# Altium schematic sheet QS30-HV.SchDoc
size A4
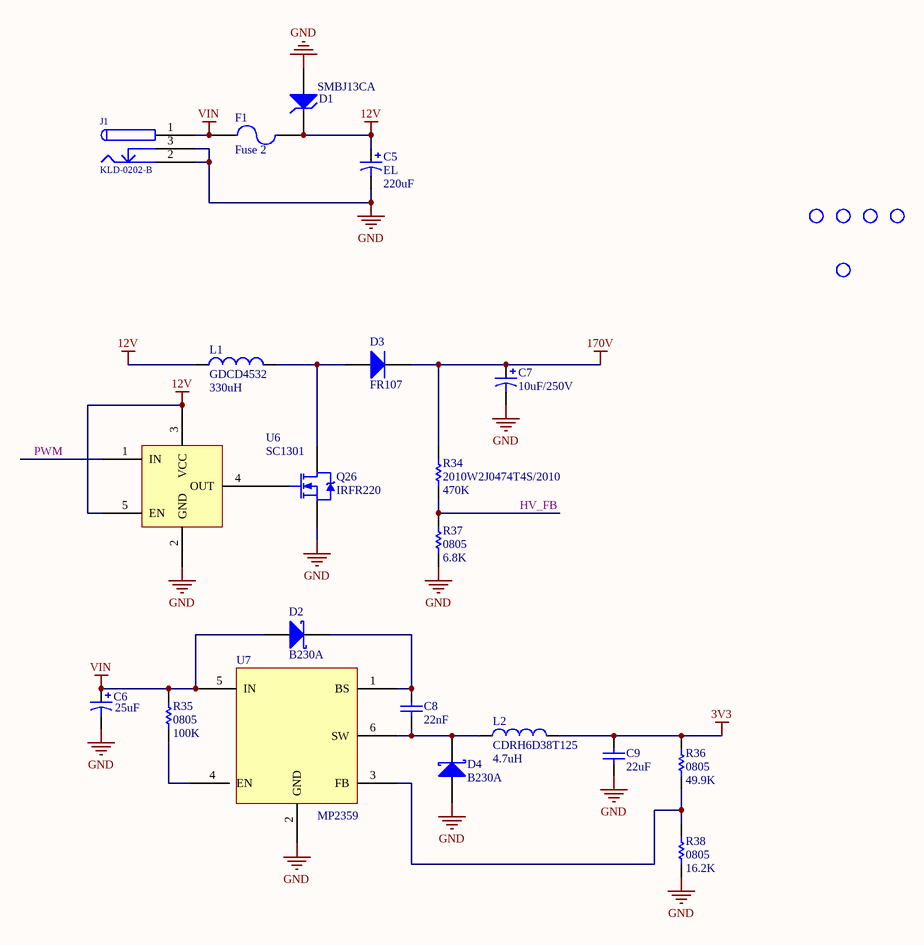
[diagram p0: QS30-HV.SchDoc]

## Parts
C5  EL  value 220uF  [220UF_16V_SMD_CAP]
C6  value 25uF  [C1210]
C7  value 10uF/250V  [C10.2 - SMD]  (hidden comment: Cap Pol1)
C8  value 22nF  [6-0805_N]  (hidden comment: Cap)
C9  value 22uF  [C1210]  (hidden comment: Cap)
D1  SMBJ13CA  [SMB]
D2  B230A  [SOD123]
D3  FR107  [DSO-C2/X1.8]
D4  B230A  [SOD123]
F1  Fuse 2  [1812]
g1  g固定过孔  [固定过孔]  (value not drawn)
g2  g固定过孔  [固定过孔]  (value not drawn)
g3  g固定过孔  [固定过孔]  (value not drawn)
g4  g固定过孔  [固定过孔]  (value not drawn)
g6  g固定过孔  [PCBComponent_1 - duplicate3]  (value not drawn)
J1  KLD-0202-B  [DC_JACK_SMT_4.0_1.7]
L1  GDCD4532  value 330uH  [GDCD4532]
L2  CDRH6D38T125  value 4.7uH  [GDCD4532]
Q26  IRFR220  [TO-252AA_N]
R34  2010W2J0474T4S/2010  value 470K  [12Z-2010]
R35  0805  value 100K  [1608[0603]]
R36  0805  value 49.9K  [6-0805_N]
R37  0805  value 6.8K  [6-0805_N]
R38  0805  value 16.2K  [6-0805_N]
U6  SC1301  [SOT23-5_L]
U7  MP2359  [SOT-23_A]

## Nets
3V3: C9.2 L2.2 R36.2
12V: C5.1 D1.2(K) F1.2 L1.1 U6.3(VCC) U6.5(EN)
170V: C7.1 D3.2(K) R34.2
GND: C5.2 C6.2 C7.2 C9.1 D1.1(A) D4.1(A) J1.2 J1.3 Q26.3(S) R37.1 R38.1 U6.2(GND) U7.2(GND)
VIN: C6.1 D2.1(A) F1.1 J1.1 R35.2 U7.5(IN)
HV_FB: R34.1 R37.2
PWM: U6.1(IN)
NetC8_1: C8.1 D4.2(K) L2.1 U7.6(SW)
NetC8_2: C8.2 D2.2(K) U7.1(BS)
NetD3_1: D3.1(A) L1.2 Q26.4(D)
NetQ26_1: Q26.1(G) U6.4(OUT)
NetR35_1: R35.1 U7.4(EN)
NetR36_1: R36.1 R38.2 U7.3(FB)

## Library data of the parts
C5-C7 = Cap Pol1: Polarized Capacitor (Radial); Published: 8-Jun-2000; LatestRevisionDate: 17-Jul-2002; LatestRevisionNote: Re-released for DXP Platform.; PackageReference: RB7.6-15; Publisher: Altium Limited; PackageDescription: Polarized Capacitor (Radial); 2 Leads
C8 C9 = Cap: Capacitor; Published: 8-Jun-2000; LatestRevisionDate: 17-Jul-2002; LatestRevisionNote: Re-released for DXP Platform.; PackageReference: RAD-0.3; Publisher: Altium Limited; PackageDescription: Radial Cap, Thru-Hole; 2 Leads; 0.3 in Pin Spacing
D1 = D Zener: Zener Diode; Published: 8-Jun-2000; LatestRevisionDate: 17-Jul-2002; LatestRevisionNote: Re-released for DXP Platform.; PackageReference: DIODE-0.7; Publisher: Altium Limited; PackageDescription: Diode, Thru-Hole; 2 Leads; 0.7 in Pin Spacing
D2 D4 = D Schottky: Schottky Diode; Published: 8-Jun-2000; LatestRevisionDate: 17-Jul-2002; LatestRevisionNote: Re-released for DXP Platform.; PackageReference: SMB; Publisher: Altium Limited; PackageDescription: DO-214-AA/SMB; 2 C-Bend Leads; Body 5.3 x 3.6 mm, inc. leads (LxW); Code_JEDEC: DO-214-AA
D3 = Diode 1N914: High Conductance Fast Diode; Published: 8-Jun-2000; LatestRevisionDate: 17-Jul-2002; LatestRevisionNote: Re-released for DXP Platform.; DatasheetVersion: 1997; PackageReference: DO-35; Publisher: Altium Limited; PackageDescription: Diode, Axial; Body 3.8 x 1.9 mm (LxDia. max), Lead Dia. 0.53 mm (max); Code_JEDEC: DO-204-AH; ComponentLink1Description: Manufacturer Link; ComponentLink1URL: http://www.fairchildsemi.com/; ComponentLink2Description: Datasheet; ComponentLink2URL: http://www.fairchildsemi.com/ds/1N%2F1N4448.pdf
F1 = Fuse 2: Fuse; Published: 8-Jun-2000; LatestRevisionDate: 17-Jul-2002; LatestRevisionNote: Re-released for DXP Platform.; PackageReference: PIN-W2/E2.8; Publisher: Altium Limited; PackageDescription: Thru-Hole; 2 Leads
J1 = KLD-0202-B: Low Voltage Power Supply Connector; Manufacturer: Kycon; AEMS Code: 3510211
L1 L2 = Inductor: Code_IEC: 1005; Published: 8-Jun-2000; LatestRevisionDate: 17-Jul-2002; LatestRevisionNote: Re-released for DXP Platform.; PackageReference: 0402-A; Publisher: Altium Limited; Code_JEITA: 0402
Q26 = IRFR220: HEXFET Power MOSFET; Note: Pin 2 is trimmed and is electrically connected to Drain.; Published: 8-Jun-2000; LatestRevisionDate: 20-Nov-2009; LatestRevisionNote: IPC-7351 Footprint Added.; DatasheetVersion: PD-9.525D; PackageVersion: Feb-2003; PackageReference: TO-252AA; Publisher: Altium Limited; PackageDescription: 3-Pin HEXFET Package 2.28 mm Pitch, 9.9 mm Lead Span; Code_JEDEC: TO-252-AA; ComponentLink1Description: Manufacturer Link; ComponentLink1URL: http://www.irf.com/; ComponentLink2Description: Datasheet; ComponentLink2URL: http://www.irf.com/product-info/datasheets/data/irfr220.pdf
R34-R38 = Res1: Resistor; Published: 8-Jun-2000; LatestRevisionDate: 17-Jul-2002; LatestRevisionNote: Re-released for DXP Platform.; PackageReference: AXIAL-0.3; Publisher: Altium Limited; PackageDescription: Axial Device, Thru-Hole; 2 Leads; 0.3 in Pin Spacing